# EAGLE design LED Test (EAGLE 9.6.2)
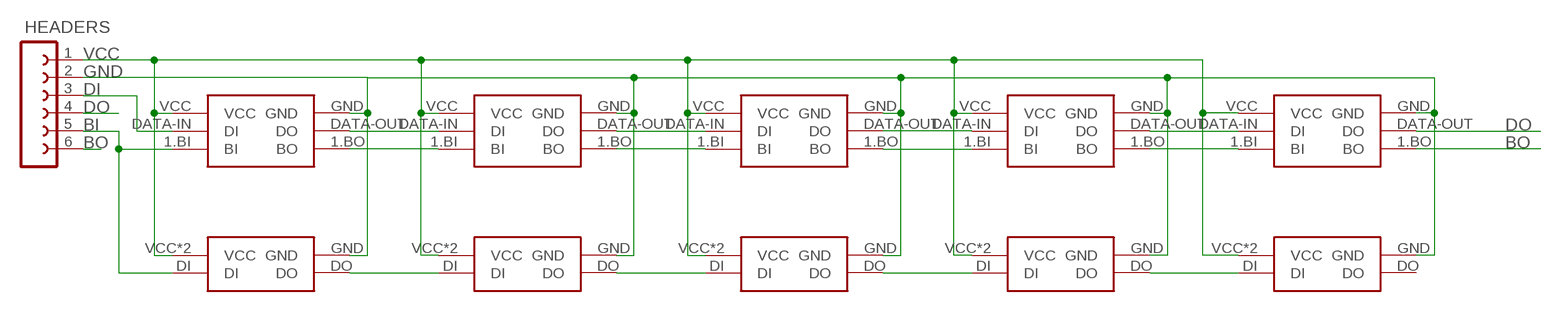
[diagram p0: schematic, sheet 1]

## Parts
HEADERS  FE06-1  [FE06]
U$1  OPTO-PIXEL.COMBINEDCOMBINED-V1.04  [COMBINED4]
U$2  OPTO-PIXEL.COMBINEDCOMBINED-V1.04  [COMBINED4]
U$3  OPTO-PIXEL.COMBINEDCOMBINED-V1.04  [COMBINED4]
U$4  OPTO-PIXEL.COMBINEDCOMBINED-V1.04  [COMBINED4]
U$5  OPTO-PIXEL.COMBINEDCOMBINED-V1.04  [COMBINED4]
U$6  OPTO-PIXEL.IN-PI55TBTPRPGPBIN-PI55TBTPRPGPB  [IN-PI55TBTPRPGPB]
U$7  OPTO-PIXEL.IN-PI55TBTPRPGPBIN-PI55TBTPRPGPB  [IN-PI55TBTPRPGPB]
U$8  OPTO-PIXEL.IN-PI55TBTPRPGPBIN-PI55TBTPRPGPB  [IN-PI55TBTPRPGPB]
U$9  OPTO-PIXEL.IN-PI55TBTPRPGPBIN-PI55TBTPRPGPB  [IN-PI55TBTPRPGPB]
U$10  OPTO-PIXEL.IN-PI55TBTPRPGPBIN-PI55TBTPRPGPB  [IN-PI55TBTPRPGPB]

## Nets
BI: HEADERS.5 U$1.1.BI(BI) U$6.DI
BO: HEADERS.6 U$5.1.BO(BO)
DI: HEADERS.3 U$1.DATA-IN(DI)
DO: HEADERS.4 U$5.DATA-OUT(DO)
GND: HEADERS.2 U$1.GND U$2.GND U$3.GND U$4.GND U$5.GND U$6.GND U$7.GND U$8.GND U$9.GND U$10.GND
N$1: U$1.DATA-OUT(DO) U$2.DATA-IN(DI)
N$2: U$1.1.BO(BO) U$2.1.BI(BI)
N$3: U$2.DATA-OUT(DO) U$3.DATA-IN(DI)
N$4: U$2.1.BO(BO) U$3.1.BI(BI)
N$5: U$3.1.BO(BO) U$4.1.BI(BI)
N$6: U$3.DATA-OUT(DO) U$4.DATA-IN(DI)
N$7: U$4.DATA-OUT(DO) U$5.DATA-IN(DI)
N$8: U$4.1.BO(BO) U$5.1.BI(BI)
N$9: U$6.DO U$7.DI
N$10: U$7.DO U$8.DI
N$11: U$8.DO U$9.DI
N$12: U$9.DO U$10.DI
VCC: HEADERS.1 U$1.VCC U$2.VCC U$3.VCC U$4.VCC U$5.VCC U$6.VCC U$6.VDD(VCC) U$7.VCC U$7.VDD(VCC) U$8.VCC U$8.VDD(VCC) U$9.VCC U$9.VDD(VCC) U$10.VCC U$10.VDD(VCC)
Unconnected: U$10.DO

## Library data of the parts
HEADERS = con-lsta:FE06-1: FEMALE HEADER; OC_FARNELL: unknown; OC_NEWARK: unknown
U$1-U$5 = LED Test:OPTO-PIXEL.COMBINED
U$6-U$10 = LED Test:OPTO-PIXEL.IN-PI55TBTPRPGPB

## Board
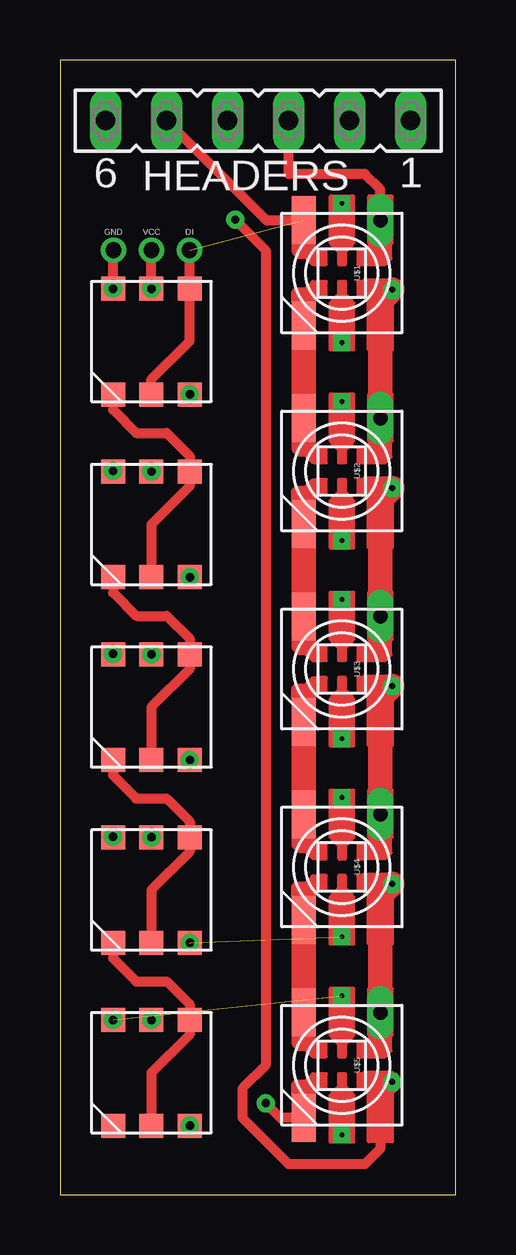
[diagram p1: board, top side]
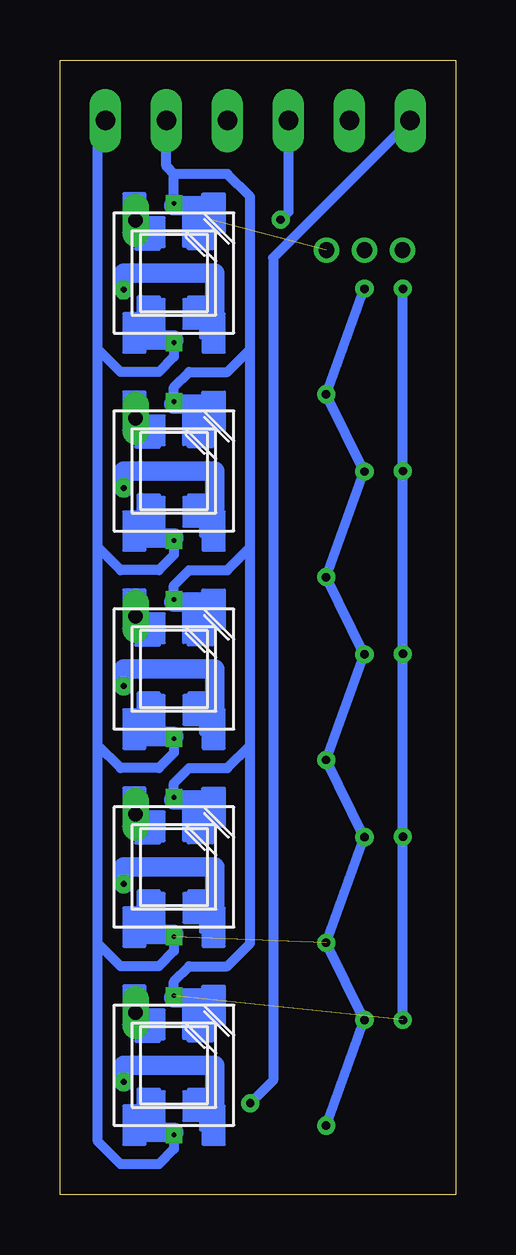
[diagram p2: board, bottom side, seen from below]

Size 16.5 x 47.3 mm. Coordinates in mm from the lower left corner, seen from the top.
Outline: 0,0 16.5,0 16.5,47.3 0,47.3 0,0
Copper layers (1*16): Top 0.035mm / dielectric 1.5mm / Bottom 0.035mm
Design rules "default": minimum track width 6mil, minimum drill 0.35mm, track to track 6mil, track to pad 6mil, pad to pad 6mil, via to via 6mil, smd to smd 6mil, copper to edge 40mil, drill to drill 6mil, minimum pad ring 10mil, minimum via ring 8mil, stop-mask expansion 4mil, vias tented up to drill 0mil, thermal gap 10mil

### Footprints (pad centres in the part's own frame; a part is rotated, then mirrored left to right if it is on the bottom)
FE06 = drill 0.813 long: 1 -6.35,0; 2 -3.81,0; 3 -1.27,0; 4 1.27,0; 5 3.81,0; 6 6.35,0
COMBINED4 = smd 2 x 1: 1.BI -2.2,-1.6; 1.BO 2.2,-1.6 | drill 0.6 long: DATA-IN -2.2,1.6 | drill 0.25 octagon: DATA-OUT 0.7,2.1 | drill 0.2 square: GND -2.9,0; VCC 2.9,0
IN-PI55TBTPRPGPB = smd 1 x 1: DI 2.2,0; DO 2.2,-1.6; GND -2.2,-1.6; NC -2.2,1.6; VCC -2.2,0; VDD 2.2,1.6

### Placement (x,y rotation side)
HEADERS  8.26,44.77 180 top
U$1  11.75,38.42 270 top
U$2  11.75,30.16 270 top
U$3  11.75,21.91 270 top
U$4  11.75,13.65 270 top
U$5  11.75,5.4 270 top
U$6  3.81,35.56 270 top
U$7  3.81,27.94 270 top
U$8  3.81,20.32 270 top
U$9  3.81,12.7 270 top
U$10  3.81,5.08 270 top

### Tracks (layer width: path | path; a pad name or v marks a point on that pad's centre or on a via)
BI  (via drill 0.65)  (1 unrouted)
  Top 0.406: HEADERS.5 8.6,40.62 U$1.1.BI | U$6.DI 3.81,33.99 5.4,35.58 v5.4,39.37
BO  (via drill 0.35)
  Top 0.406: U$5.1.BO 9.19,3.2 v8.57,3.81
  Bottom 0.406: v8.57,3.81 7.62,4.76 7.62,39.05 HEADERS.6
DI
  Top 0.406: U$1.DATA-IN 13.34,40.63 13.34,41.91 12.7,42.55 9.53,42.55 HEADERS.3
DO  (via drill 0.35)
  Top 0.406: U$5.DATA-OUT 13.34,4.18 13.34,1.91 12.7,1.27 9.53,1.27 7.62,3.17 7.62,4.45 8.57,5.4 8.57,39.37 v7.3,40.64
  Bottom 0.406: v7.3,40.64 6.99,40.96 HEADERS.4
GND  (via drill 0.35, 0.65)  (1 unrouted)
  Top 0.406: U$7.GND v2.21,30.16 | U$8.GND v2.21,22.54 | U$9.GND v2.21,14.92 | U$6.GND 2.22,37.77 v2.22,39.37
  Bottom 0.406: U$2.GND 11.75,33.66 11.11,34.29 9.53,34.29 8.57,35.24 | U$3.GND 11.75,25.4 11.11,26.04 9.53,26.04 8.57,26.99 | 8.57,26.99 8.57,35.24 | U$4.GND 11.75,17.14 11.11,17.78 9.53,17.78 8.57,18.73 | 8.57,18.73 8.57,26.99 | U$5.GND 11.75,8.89 11.11,9.53 9.53,9.53 8.57,10.48 8.57,18.73 | 8.57,35.24 8.57,41.59 9.53,42.55 11.75,42.55 | 11.75,42.55 12.06,42.86 HEADERS.2 | U$1.GND 11.75,42.55 | U$10.GND v2.21,14.92 v2.21,22.54 v2.21,30.16 U$6.GND
  other vias: 2.21,7.28 2.21,37.76
N$1
  Top 1.016: U$2.DATA-IN 13.35,37.22 U$1.DATA-OUT
N$2
  Top 1.016: U$1.1.BO U$2.1.BI
N$3
  Top 1.016: U$3.DATA-IN 13.35,28.96 U$2.DATA-OUT
N$4
  Top 1.016: U$3.1.BI U$2.1.BO
N$5
  Top 1.016: U$3.1.BO U$4.1.BI
N$6
  Top 1.016: U$4.DATA-IN 13.35,20.71 U$3.DATA-OUT
N$7
  Top 1.016: U$5.DATA-IN 13.35,12.45 U$4.DATA-OUT
N$8
  Top 1.016: U$5.1.BI U$4.1.BO
N$9
  Top 0.406: U$6.DO 2.21,32.72 3.17,31.75 4.45,31.75 5.4,30.8 5.4,29.53 3.81,27.94 U$7.DI
N$10
  Top 0.406: U$7.DO 2.21,25.09 3.17,24.13 4.45,24.13 5.4,23.18 5.4,21.91 3.81,20.32 U$8.DI
N$11
  Top 0.406: U$8.DO 2.21,17.48 3.17,16.51 4.45,16.51 5.4,15.56 5.4,14.29 3.81,12.7 U$9.DI
N$12
  Top 0.406: U$9.DO 2.21,9.86 3.17,8.89 4.45,8.89 5.4,7.94 5.4,6.67 3.81,5.08 U$10.DI
VCC  (via drill 0.35, 0.65)  (1 unrouted)
  Top 0.406: U$6.VCC v3.81,39.37
  Bottom 0.406: U$1.VCC 11.75,34.92 12.38,34.29 13.97,34.29 14.92,35.24 | HEADERS.1 14.92,44.45 14.92,35.24 | U$2.VCC 11.75,26.67 12.38,26.04 13.97,26.04 14.92,26.99 | 14.92,26.99 14.92,35.24 | U$3.VCC 11.75,18.41 12.38,17.78 13.97,17.78 14.92,18.73 | 14.92,18.73 14.92,26.99 | U$4.VCC 11.75,10.16 12.38,9.53 13.97,9.53 14.92,10.48 | 14.92,10.48 14.92,18.73 | 14.92,10.48 14.92,2.22 13.97,1.27 12.38,1.27 11.75,1.91 U$5.VCC | U$10.VDD U$10.VCC U$9.VDD U$9.VCC U$8.VDD U$8.VCC U$7.VDD 3.81,30.16 U$7.VCC U$6.VDD U$6.VCC
  other vias: 5.41,2.88 3.81,7.28 5.41,10.5 3.81,14.9 5.41,18.12 3.81,22.52 5.41,25.74 3.81,30.14 5.41,33.36 3.81,37.76

### Text on the board
tNames: GND | VCC | DI